# EasyEDA Pro project ProDoc_SMD test 2_2025-04-19.epro, schematic Schematic1_3
Board Name: SMD test 2; Create Date: 2025-02-23; Page Name: P1; Project Name: OASman Manifold Board v3.1.1; Schematic Name: Schematic1_3; Update Date: 2025-03-29; Company: EasyEDA.com; Page Size: A4; Version: V1.0
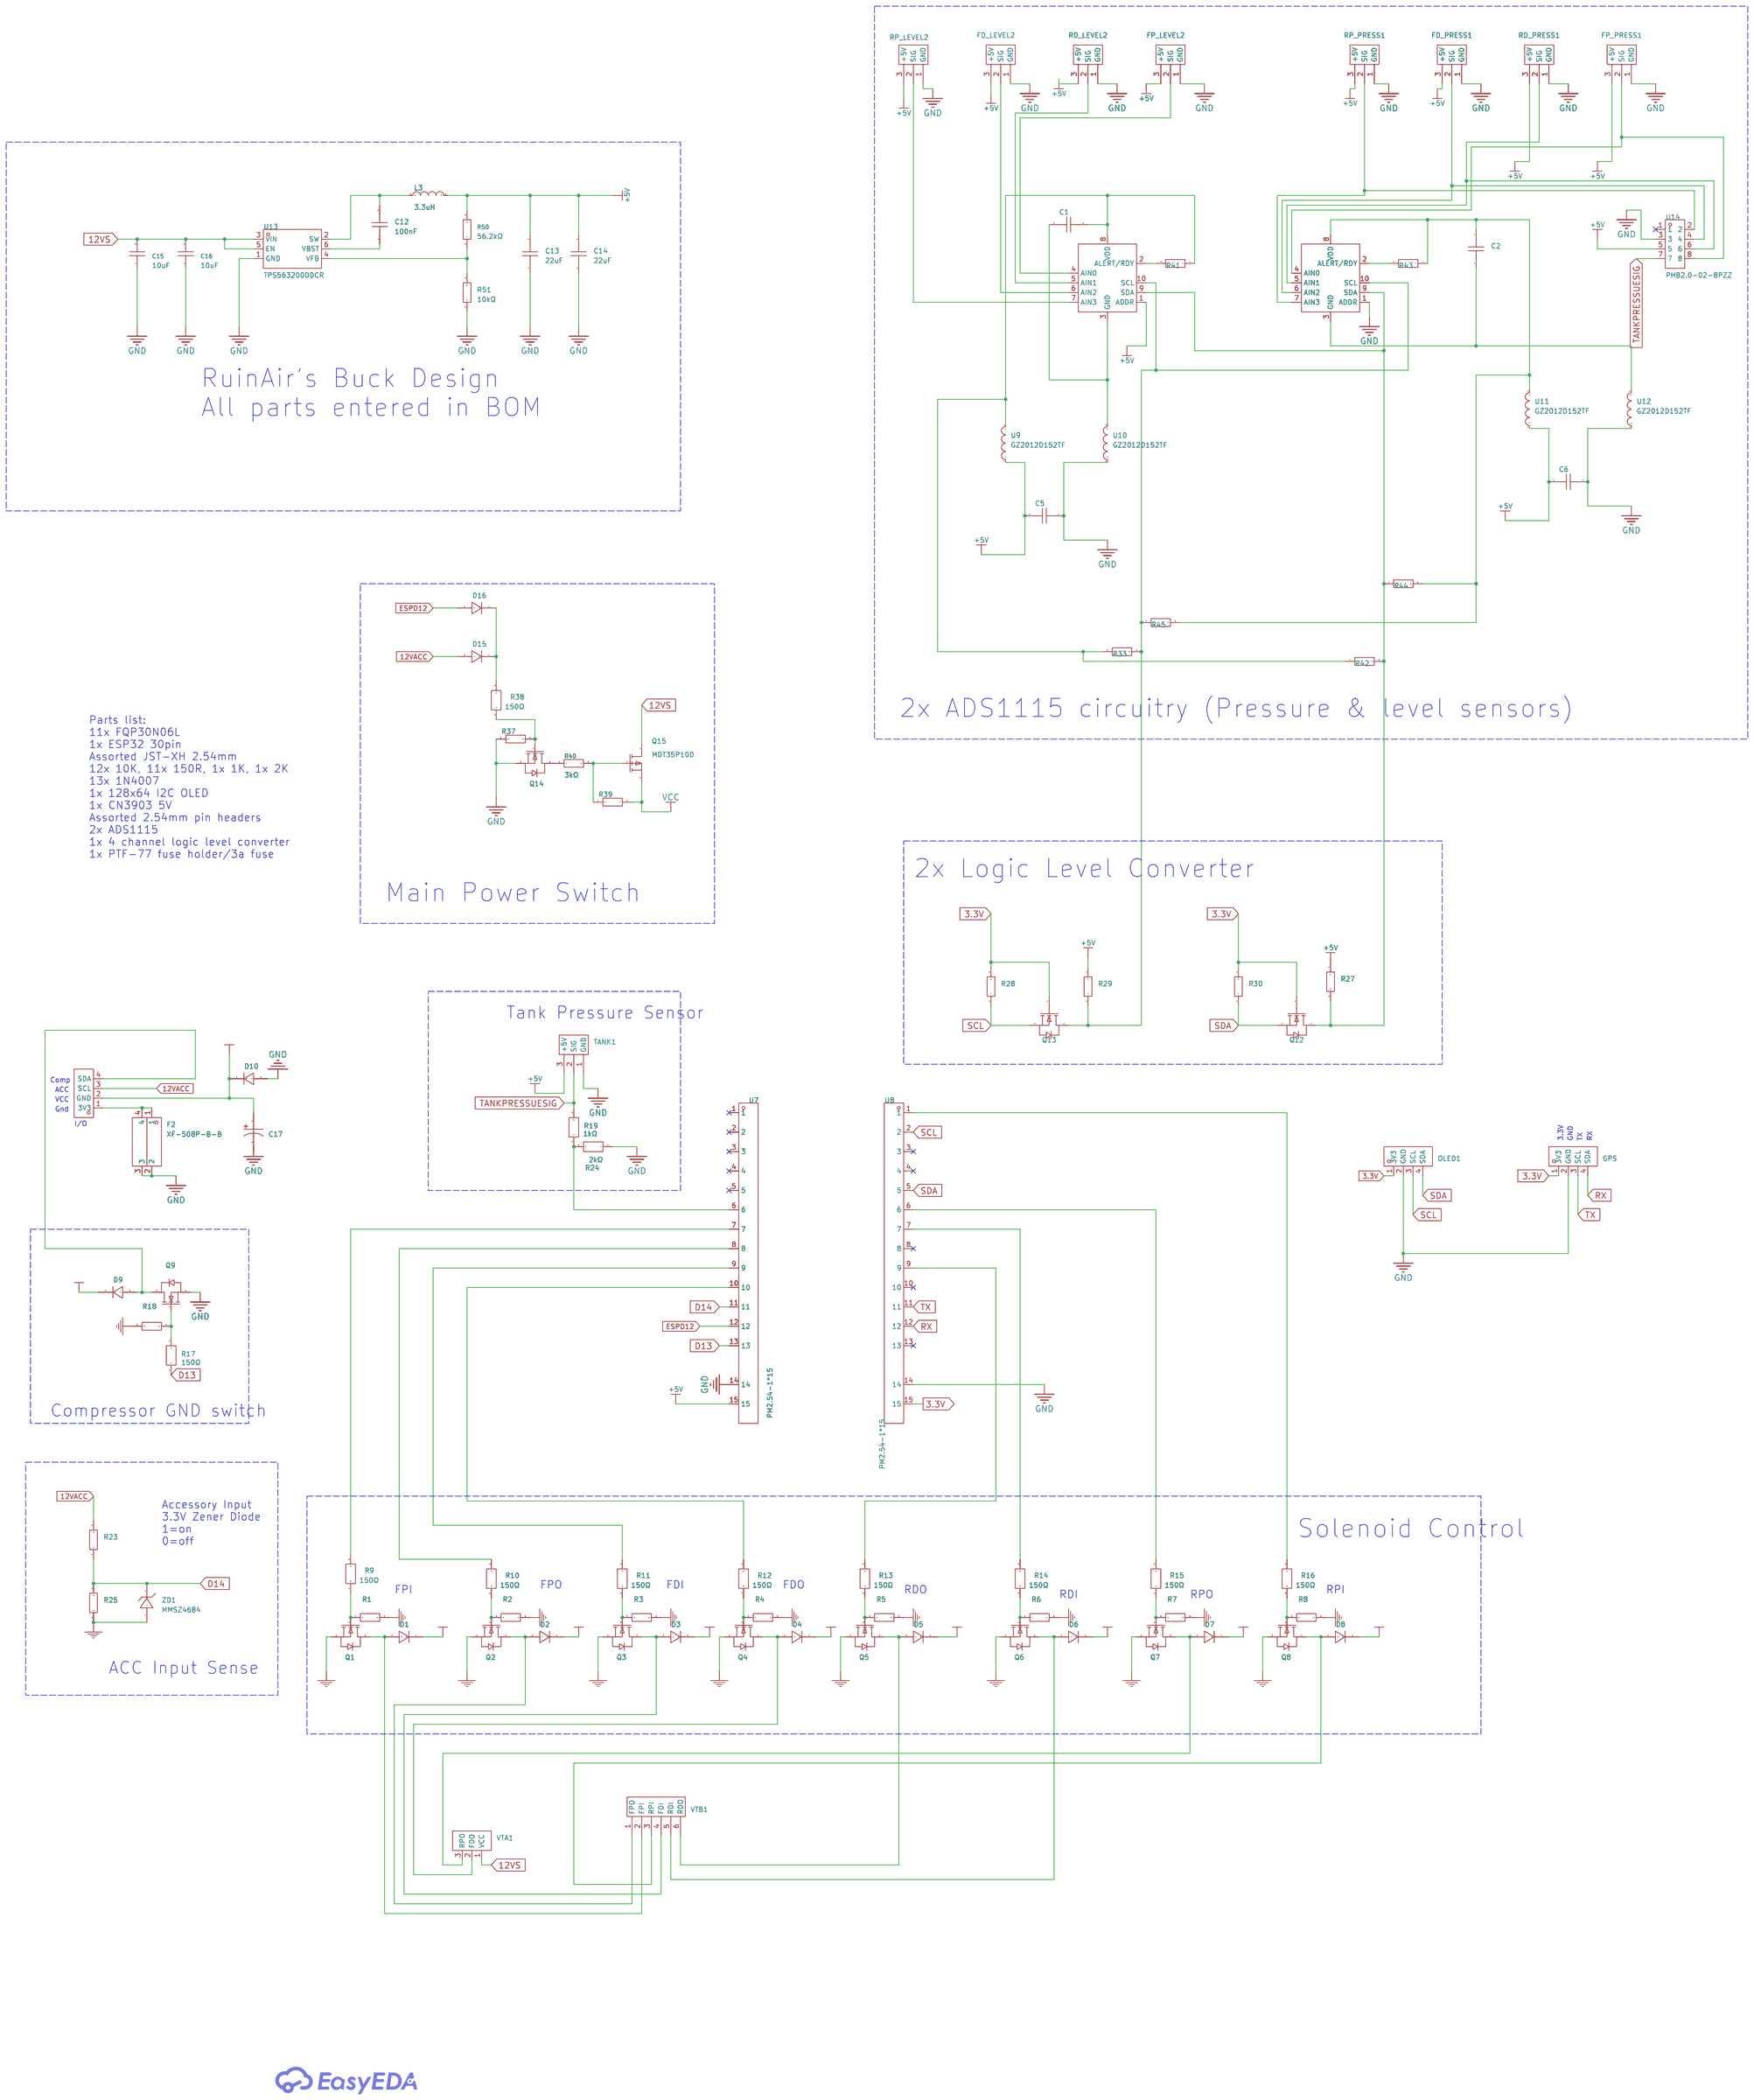
[diagram p0: schematic sheet]

## Parts
C1  1uF  [C0603]
C2  1uF  [C0603]
C5  1uF  [C0603]
C6  1uF  [C0603]
C12  100nF  [C0402]
C13  22uF  [C0805]
C14  22uF  [C0805]
C15  10uF  [C1206]
C16  10uF  [C1206]
C17  1000uF  [CAP-SMD_BD10.0-L10.3-W10.3-FD]
CN1  XH-4A绿色  [CONN-TH_XH-4A-1]
D1  SM4007PL  [SOD-123F_L2.8-W1.8-LS3.7-RD]
D2  SM4007PL  [SOD-123F_L2.8-W1.8-LS3.7-RD]
D3  SM4007PL  [SOD-123F_L2.8-W1.8-LS3.7-RD]
D4  SM4007PL  [SOD-123F_L2.8-W1.8-LS3.7-RD]
D5  SM4007PL  [SOD-123F_L2.8-W1.8-LS3.7-RD]
D6  SM4007PL  [SOD-123F_L2.8-W1.8-LS3.7-RD]
D7  SM4007PL  [SOD-123F_L2.8-W1.8-LS3.7-RD]
D8  SM4007PL  [SOD-123F_L2.8-W1.8-LS3.7-RD]
D9  SM4007PL  [SOD-123F_L2.8-W1.8-LS3.7-RD]
D10  SM4007PL  [SOD-123F_L2.8-W1.8-LS3.7-RD]
D15  SM4007PL  [SOD-123F_L2.8-W1.8-LS3.7-RD]
D16  SM4007PL  [SOD-123F_L2.8-W1.8-LS3.7-RD]
F2  XF-508P-B-B  [FUSE-TH_4P-L16.0-W6.7]
FD_LEVEL2  XH-3A  [CONN-TH_XH-3A]
FD_PRESS1  XH-3A  [CONN-TH_XH-3A]
FP_LEVEL2  XH-3A  [CONN-TH_XH-3A]
FP_PRESS1  XH-3A  [CONN-TH_XH-3A]
GPS  XH-4A绿色  [CONN-TH_XH-4A-1]
L3  3.3uH  [IND-SMD_L4.5-W4.1_SL0420]
OLED1  XH-4A绿色  [CONN-TH_XH-4A-1]
Q1  MDT30N06L  [TO-252-2_L6.6-W5.6-P4.60-LS9.7-BR]
Q2  MDT30N06L  [TO-252-2_L6.6-W5.6-P4.60-LS9.7-BR]
Q3  MDT30N06L  [TO-252-2_L6.6-W5.6-P4.60-LS9.7-BR]
Q4  MDT30N06L  [TO-252-2_L6.6-W5.6-P4.60-LS9.7-BR]
Q5  MDT30N06L  [TO-252-2_L6.6-W5.6-P4.60-LS9.7-BR]
Q6  MDT30N06L  [TO-252-2_L6.6-W5.6-P4.60-LS9.7-BR]
Q7  MDT30N06L  [TO-252-2_L6.6-W5.6-P4.60-LS9.7-BR]
Q8  MDT30N06L  [TO-252-2_L6.6-W5.6-P4.60-LS9.7-BR]
Q9  MDT30N06L  [TO-252-2_L6.6-W5.6-P4.60-LS9.7-BR]
Q12  BSS138  [SOT-23-3_L2.9-W1.6-P1.90-LS2.8-BR]
Q13  BSS138  [SOT-23-3_L2.9-W1.6-P1.90-LS2.8-BR]
Q14  MDT30N06L  [TO-252-2_L6.6-W5.6-P4.60-LS9.7-BR]
Q15  MDT35P10D  [TO-252-2_L6.6-W6.1-P4.57-LS9.9-BR-CW]
R1  10kΩ  [R1206]
R2  10kΩ  [R1206]
R3  10kΩ  [R1206]
R4  10kΩ  [R1206]
R5  10kΩ  [R1206]
R6  10kΩ  [R1206]
R7  10kΩ  [R1206]
R8  10kΩ  [R1206]
R9  150Ω  [R1206]
R10  150Ω  [R1206]
R11  150Ω  [R1206]
R12  150Ω  [R1206]
R13  150Ω  [R1206]
R14  150Ω  [R1206]
R15  150Ω  [R1206]
R16  150Ω  [R1206]
R17  150Ω  [R1206]
R18  10kΩ  [R1206]
R19  1kΩ  [R1206]
R23  10kΩ  [R1206]
R24  2kΩ  [R1206]
R25  10kΩ  [R1206]
R27  10kΩ  [R1206]
R28  10kΩ  [R1206]
R29  10kΩ  [R1206]
R30  10kΩ  [R1206]
R33  1MΩ  [R1206]
R37  10kΩ  [R1206]
R38  150Ω  [R1206]
R39  10kΩ  [R1206]
R40  3kΩ  [R1206]
R41  1MΩ  [R1206]
R42  1MΩ  [R1206]
R43  1MΩ  [R1206]
R44  1MΩ  [R1206]
R45  1MΩ  [R1206]
R50  56.2kΩ  [R0402]
R51  10kΩ  [R0402]
RD_LEVEL2  XH-3A  [CONN-TH_XH-3A]
RD_PRESS1  XH-3A  [CONN-TH_XH-3A]
RP_LEVEL2  XH-3A  [CONN-TH_XH-3A]
RP_PRESS1  XH-3A  [CONN-TH_XH-3A]
TANK1  XH-3A  [CONN-TH_XH-3A]
U4  ADS1115IDGSR  [MSOP-10_L3.0-W3.0-P0.50-LS5.0-BL]
U5  ADS1115IDGSR  [MSOP-10_L3.0-W3.0-P0.50-LS5.0-BL]
U7  PM2.54-1*15  [HDR-TH_15P-P2.54-V-F]
U8  PM2.54-1*15  [HDR-TH_15P-P2.54-V-F]
U9  GZ2012D152TF  [L0805]
U10  GZ2012D152TF  [L0805]
U11  GZ2012D152TF  [L0805]
U12  GZ2012D152TF  [L0805]
U13  TPS563200DDCR  [SOT-23-6_L2.9-W1.6-P0.95-LS2.8-BR]
U14  PHB2.0-02-8PZZ  [CONN-TH_8P-P2.00_XUNPU_PHB2.0-02-8PZZ]
VTA1  XH-3A  [CONN-TH_XH-3A]
VTB1  XH-6A  [CONN-TH_6P-P2.50_XH-6A]
ZD1  MMSZ4684  [SOD-123_L2.8-W1.8-LS3.7-RD]

## Library data of the parts
C1 C2 C5 C6 = GRM188R61H105KAALD: Capacitance: Tolerance:±10% Tolerance:±10% Voltage Rated: Temperature Coefficient:; LCSC Part Name: 1uF ±10% 50V; Supplier Part: C77386; Manufacturer: muRata(村田); Supplier Footprint: 0603; JLCPCB Part Class: Extended Part; Datasheet: https://atta.szlcsc.com/upload/public/pdf/source/20170116/1484561238855.pdf; Supplier: LCSC; Tolerance: ±10%
C12 = CL05B104KB54PNC: Capacitance: Tolerance:±10% Tolerance:±10% Voltage Rated: Temperature Coefficient:; LCSC Part Name: 100nF ±10% 50V; Supplier Part: C307331; Manufacturer: SAMSUNG(三星); Supplier Footprint: 0402; JLCPCB Part Class: Basic Part; Datasheet: https://atta.szlcsc.com/upload/public/pdf/source/20160218/1457707763339.pdf; Supplier: LCSC; Tolerance: ±10%
C13 C14 = CL21A226MAQNNNE: Capacitance: Tolerance:±20% Tolerance:±20% Voltage Rated: Temperature Coefficient:; LCSC Part Name: 22uF ±20% 25V; Supplier Part: C45783; Manufacturer: SAMSUNG(三星); Supplier Footprint: 0805; JLCPCB Part Class: Basic Part; Datasheet: https://atta.szlcsc.com/upload/public/pdf/source/20160218/1457707763339.pdf; Supplier: LCSC; Tolerance: ±20%
C15 C16 = CL31A106KBHNNNE: Capacitance: Tolerance:±10% Tolerance:±10% Voltage Rated: Temperature Coefficient:; LCSC Part Name: 10uF ±10% 50V; Supplier Part: C13585; Manufacturer: SAMSUNG(三星); Supplier Footprint: 1206; JLCPCB Part Class: Basic Part; Datasheet: https://atta.szlcsc.com/upload/public/pdf/source/20160218/1457707763339.pdf; Supplier: LCSC; Tolerance: ±10%
C17 = EEEFT1E102UP: Capacitance: Tolerance:±20% Tolerance:±20% Rated Voltage: Ripple Current:1.19A@100kHz Equivalent Series Resistance(ESR): φD: L: Lifetime @ Temp:2000hrs@105℃ Operating Temperature:-55℃~+105℃ Operating Temperature:-55℃~+105℃; LCSC Part Name: 1000uF ±20% 25V; Supplier Part: C401766; Manufacturer: PANASONIC(松下); Supplier Footprint: SMD,D10xL10.2mm; JLCPCB Part Class: Extended Part; Datasheet: https://atta.szlcsc.com/upload/public/pdf/source/20190702/C401766_FFAE6A2740111919C359AC69212D5236.pdf; Supplier: LCSC; Tolerance: ±20%; Ripple Current: 1.19A@100kHz; Lifetime @ Temp: 2000hrs@105℃; Operating Temperature: -55℃~+105℃
CN1 GPS OLED1 = XH-4A绿色: Pins Structure:1x4P Pitch:- Mounting Style:- Reference Series:XH Number of Pins:4P Number of Rows:1 Number of PINs Per Row:4 Row Spacing:- Contact Material:-; LCSC Part Name: 1x4P 系列:XH; Supplier Part: C192885; Manufacturer: BOOMELE(博穆精密); Supplier Footprint: 插件,P=2.5mm; JLCPCB Part Class: Extended Part; Supplier: LCSC; Pins Structure: 1x4P; Reference Series: XH; Number of Pins: 4P; Number of Rows: 1; Number of PINs Per Row: 4
D1-D10 D15 D16 = SM4007PL_C64898: Diode Configuration: Forward Voltage (Vf@If):1.1V@1A Reverse Voltage (Vr): Rectified Current: Reverse Leakage Current:10uA@1kV; LCSC Part Name: 电压:1kV 电流:1A; Supplier Part: C64898; Manufacturer: MDD(辰达半导体); Supplier Footprint: SOD-123FL; JLCPCB Part Class: Basic Part; Datasheet: https://atta.szlcsc.com/upload/public/pdf/source/20230823/16A8FDE162764C9B685A3717F2DA3690.pdf; Supplier: LCSC; Forward Voltage (Vf@If): 1.1V@1A; Reverse Leakage Current: 10uA@1kV
F2 = XF-508P-B-B: LCSC Part Name: 汽车保险丝座 小号; Supplier Part: C19727305; Manufacturer: XFCN(兴飞); Supplier Footprint: DIP-4; JLCPCB Part Class: Extended Part; Datasheet: https://atta.szlcsc.com/upload/public/pdf/source/20231225/025E8639FF4071685633BBEE755D2F9E.pdf; Supplier: LCSC
FD_LEVEL2 FD_PRESS1 FP_LEVEL2 FP_PRESS1 RD_LEVEL2 RD_PRESS1 RP_LEVEL2 RP_PRESS1 TANK1 VTA1 = XH-3A_C2316: Pins Structure:1x3P Pitch:2.5mm Mounting Style:- Reference Series:XH Number of Pins:3P Number of Rows:1 Number of PINs Per Row:3 Row Spacing:- Contact Material:-; LCSC Part Name: 1x3P 间距:2.5mm 系列:XH; Supplier Part: C2316; Manufacturer: BOOMELE(博穆精密); Supplier Footprint: 插件,P=2.5mm; JLCPCB Part Class: Extended Part; Datasheet: https://atta.szlcsc.com/upload/public/pdf/source/20151222/1457707654251.pdf; Supplier: LCSC; Pins Structure: 1x3P; Pitch: 2.5mm; Reference Series: XH; Number of Pins: 3P; Number of Rows: 1; Number of PINs Per Row: 3
L3 = SL0420-3R3M: Inductance: Tolerance:±20% Tolerance:±20% Rated Current: Saturation Current (Isat):4A; LCSC Part Name: 3.3uH ±20% 4A; Supplier Part: C22463807; Manufacturer: 台湾陆海; Supplier Footprint: SMD,4.5x4.1mm; JLCPCB Part Class: Extended Part; Datasheet: https://atta.szlcsc.com/upload/public/pdf/source/20240611/8DE7D6BE1273F2E871C82A6D5C20B08D.pdf; Supplier: LCSC; Tolerance: ±20%; Saturation Current (Isat): 4A
Q1-Q9 Q14 = MDT30N06L: Type:1 N-channel Drain Source Voltage (Vdss):60V Continuous Drain Current (Id): Drain Source On Resistance (RDS(on)@Vgs,Id):40mΩ@4.5V Power Dissipation (Pd): Gate Threshold Voltage (Vgs(th)@Id):1.8V@250uA Total Gate Charge (Qg@Vgs):21nC@10V Input Capacita; LCSC Part Name: 1个N沟道 耐压:60V 电流:30A; Supplier Part: C5240683; Manufacturer: minos(迈诺斯); Supplier Footprint: TO-252-2L; JLCPCB Part Class: Extended Part; Datasheet: https://atta.szlcsc.com/upload/public/pdf/source/20240829/EA64E09E95BF58FCAC7BF20D9AEBC519.pdf; Supplier: LCSC; Type: 1 N-channel; Drain Source Voltage (Vdss): 60V; Drain Source On Resistance (RDS(on)@Vgs,Id): 40mΩ@4.5V; Gate Threshold Voltage (Vgs(th)@Id): 1.8V@250uA; Total Gate Charge (Qg@Vgs): 21nC@10V; Input Capacitance (Ciss@Vds): 670pF; Reverse Transfer Capacitance (Crss@Vds): 66pF; Operating Temperature: -55℃~+175℃
Q12 Q13 = BSS138_C112239: Type:1 N-Channel Drain Source Voltage (Vdss): Continuous Drain Current (Id): Power Dissipation (Pd): Drain Source On Resistance (RDS(on)@Vgs,Id):3.5Ω@10V,220mA Gate Threshold Voltage (Vgs(th)@Id):1.5V@1mA; LCSC Part Name: 1个N沟道 耐压:50V 电流:220mA; Supplier Part: C112239; Manufacturer: SHIKUES(时科); Supplier Footprint: SOT-23; JLCPCB Part Class: Extended Part; Datasheet: https://atta.szlcsc.com/upload/public/pdf/source/20170720/1500524147280.pdf; Supplier: LCSC; Type: 1 N-Channel; Drain Source On Resistance (RDS(on)@Vgs,Id): 3.5Ω@10V,220mA; Gate Threshold Voltage (Vgs(th)@Id): 1.5V@1mA
Q15 = MDT35P10D: Type:1 Piece P-Channel Drain Source Voltage (Vdss): Continuous Drain Current (Id): Drain Source On Resistance (RDS(on)@Vgs,Id):26mΩ@10V,15A Power Dissipation (Pd): Gate Threshold Voltage (Vgs(th)@Id):2V@250uA Total Gate Charge (Qg@Vgs):40nC@10V Input Capa; LCSC Part Name: 1个P沟道 耐压:100V 电流:35A; Supplier Part: C5890267; Manufacturer: minos(迈诺斯); Supplier Footprint: TO252; JLCPCB Part Class: Extended Part; Datasheet: https://atta.szlcsc.com/upload/public/pdf/source/20230704/A90682651C9529CA52851179CB8911E0.pdf; Supplier: LCSC; Type: 1 Piece P-Channel; Drain Source On Resistance (RDS(on)@Vgs,Id): 26mΩ@10V,15A; Gate Threshold Voltage (Vgs(th)@Id): 2V@250uA; Total Gate Charge (Qg@Vgs): 40nC@10V; Input Capacitance (Ciss@Vds): 2.315nF@25V; Reverse Transfer Capacitance (Crss@Vds): 11pF@25V
R1-R8 R18 R23 R25 R27-R30 R37 R39 = 1206W4F1002T5E: Type:Thick Film Resistors Resistance:10kΩ Tolerance:±1% Tolerance:±1% Power(Watts): Overload Voltage (Max): Temperature Coefficient:±100ppm/℃ Temperature Coefficient:±100ppm/℃ Operating Temperature Range:-55℃~+155℃ Operating Temperature Range:-55℃~+155℃; LCSC Part Name: 10kΩ ±1% 250mW 厚膜电阻; Supplier Part: C17902; Manufacturer: UNI-ROYAL(厚声); Supplier Footprint: 1206; JLCPCB Part Class: Basic Part; Datasheet: https://atta.szlcsc.com/upload/public/pdf/source/20200306/C422600_1E6D84923E4A46A82E41ADD87F860B5C.pdf; Supplier: LCSC; Type: Thick Film Resistors; Tolerance: ±1%; Temperature Coefficient: ±100ppm/℃; Operating Temperature Range: -55℃~+155℃
R9-R17 R38 = FRC1206J151 TS: Type:Thick Film Resistors Resistance: Tolerance:±5% Tolerance:±5% Power(Watts): Overload Voltage (Max): Temperature Coefficient:±100ppm/℃ Temperature Coefficient:±100ppm/℃ Operating Temperature Range:-55℃~+155℃ Operating Temperature Range:-55℃~+155℃; LCSC Part Name: 150Ω ±5% 250mW 厚膜电阻; Supplier Part: C2907432; Manufacturer: FOJAN(富捷); Supplier Footprint: 1206; JLCPCB Part Class: Extended Part; Datasheet: https://atta.szlcsc.com/upload/public/pdf/source/20211221/925EC7D7225764EE0046F22065062C87.pdf; Supplier: LCSC; Type: Thick Film Resistors; Tolerance: ±5%; Temperature Coefficient: ±100ppm/℃; Operating Temperature Range: -55℃~+155℃
R19 = FRC1206J102 TS: Type:Thick Film Resistors Resistance:1kΩ Tolerance:±5% Tolerance:±5% Power(Watts): Overload Voltage (Max): Temperature Coefficient:±100ppm/℃ Temperature Coefficient:±100ppm/℃ Operating Temperature Range:-55℃~+155℃ Operating Temperature Range:-55℃~+155℃; LCSC Part Name: 1kΩ ±5% 250mW 厚膜电阻; Supplier Part: C2907440; Manufacturer: FOJAN(富捷); Supplier Footprint: 1206; JLCPCB Part Class: Extended Part; Datasheet: https://atta.szlcsc.com/upload/public/pdf/source/20211221/925EC7D7225764EE0046F22065062C87.pdf; Supplier: LCSC; Type: Thick Film Resistors; Tolerance: ±5%; Temperature Coefficient: ±100ppm/℃; Operating Temperature Range: -55℃~+155℃
R24 = FRC1206J202 TS: Type:Thick Film Resistors Resistance:2kΩ Tolerance:±5% Tolerance:±5% Power(Watts): Overload Voltage (Max): Temperature Coefficient:±100ppm/℃ Temperature Coefficient:±100ppm/℃ Operating Temperature Range:-55℃~+155℃ Operating Temperature Range:-55℃~+155℃; LCSC Part Name: 2kΩ ±5% 250mW 厚膜电阻; Supplier Part: C2907466; Manufacturer: FOJAN(富捷); Supplier Footprint: 1206; JLCPCB Part Class: Extended Part; Datasheet: https://atta.szlcsc.com/upload/public/pdf/source/20211221/925EC7D7225764EE0046F22065062C87.pdf; Supplier: LCSC; Type: Thick Film Resistors; Tolerance: ±5%; Temperature Coefficient: ±100ppm/℃; Operating Temperature Range: -55℃~+155℃
R33 R41-R45 = 1206W4F1004T5E: Type:Thick Film Resistors Resistance:1MΩ Tolerance:±1% Tolerance:±1% Power(Watts): Overload Voltage (Max): Temperature Coefficient:±100ppm/℃ Temperature Coefficient:±100ppm/℃ Operating Temperature Range:-55℃~+155℃ Operating Temperature Range:-55℃~+155℃; LCSC Part Name: 1MΩ ±1% 250mW 厚膜电阻; Supplier Part: C17927; Manufacturer: UNI-ROYAL(厚声); Supplier Footprint: 1206; JLCPCB Part Class: Basic Part; Datasheet: https://atta.szlcsc.com/upload/public/pdf/source/20200306/C422600_1E6D84923E4A46A82E41ADD87F860B5C.pdf; Supplier: LCSC; Type: Thick Film Resistors; Tolerance: ±1%; Temperature Coefficient: ±100ppm/℃; Operating Temperature Range: -55℃~+155℃
R40 = 1206W4F3001T5E: Type:Thick Film Resistors Resistance:3kΩ Tolerance:±1% Tolerance:±1% Power(Watts): Overload Voltage (Max): Temperature Coefficient:±100ppm/℃ Temperature Coefficient:±100ppm/℃ Operating Temperature Range:-55℃~+155℃ Operating Temperature Range:-55℃~+155℃; LCSC Part Name: 3kΩ ±1% 250mW 厚膜电阻; Supplier Part: C18012; Manufacturer: UNI-ROYAL(厚声); Supplier Footprint: 1206; JLCPCB Part Class: Extended Part; Datasheet: https://atta.szlcsc.com/upload/public/pdf/source/20200306/C422600_1E6D84923E4A46A82E41ADD87F860B5C.pdf; Supplier: LCSC; Type: Thick Film Resistors; Tolerance: ±1%; Temperature Coefficient: ±100ppm/℃; Operating Temperature Range: -55℃~+155℃
R50 = 0402WGF5622TCE: Type:Thick Film Resistors Resistance:56.2kΩ Tolerance:±1% Tolerance:±1% Power(Watts): Overload Voltage (Max): Temperature Coefficient:±100ppm/℃ Temperature Coefficient:±100ppm/℃ Operating Temperature Range:-55℃~+155℃ Operating Temperature Range:-55℃~+155℃; LCSC Part Name: 56.2kΩ ±1% 62.5mW 厚膜电阻; Supplier Part: C54968; Manufacturer: UNI-ROYAL(厚声); Supplier Footprint: 0402; JLCPCB Part Class: Extended Part; Datasheet: https://atta.szlcsc.com/upload/public/pdf/source/20200306/C422600_1E6D84923E4A46A82E41ADD87F860B5C.pdf; Supplier: LCSC; Type: Thick Film Resistors; Tolerance: ±1%; Temperature Coefficient: ±100ppm/℃; Operating Temperature Range: -55℃~+155℃
R51 = 0402WGF1002TCE: Type:Thick Film Resistors Resistance:10kΩ Tolerance:±1% Tolerance:±1% Power(Watts): Overload Voltage (Max): Temperature Coefficient:±100ppm/℃ Temperature Coefficient:±100ppm/℃ Operating Temperature Range:-55℃~+155℃ Operating Temperature Range:-55℃~+155℃; LCSC Part Name: 10kΩ ±1% 62.5mW 厚膜电阻; Supplier Part: C25744; Manufacturer: UNI-ROYAL(厚声); Supplier Footprint: 0402; JLCPCB Part Class: Basic Part; Datasheet: https://atta.szlcsc.com/upload/public/pdf/source/20200306/C422600_1E6D84923E4A46A82E41ADD87F860B5C.pdf; Supplier: LCSC; Type: Thick Film Resistors; Tolerance: ±1%; Temperature Coefficient: ±100ppm/℃; Operating Temperature Range: -55℃~+155℃
U4 U5 = ADS1115IDGSR: Interface:I2C differential input:Yes number of channels:2 Supply Voltage:2V~5.5V Supply Voltage:2V~5.5V sampling frequency:860Hz resolution:16Bit Operating Temperature:-40℃~+125℃ Operating Temperature:-40℃~+125℃; LCSC Part Name: 具有内部基准、振荡器和可编程比较器且兼容 I2C 的ADS111x、超小型、低功耗 860SPS、16位ADC; Supplier Part: C37593; Manufacturer: TI(德州仪器); Supplier Footprint: VSSOP-10; JLCPCB Part Class: Extended Part; Datasheet: https://www.ti.com/cn/lit/gpn/ads1115; Supplier: LCSC; Interface: I2C; differential input: Yes; number of channels: 2; Supply Voltage: 2V~5.5V; sampling frequency: 860Hz; resolution: 16Bit; Operating Temperature: -40℃~+125℃
U7 U8 = PM2.54-1*15: Holes Structure:1x15P Pitch:2.54mm Number of Rows:Plugin Contact Plating:Gold; LCSC Part Name: 1x15P 间距:2.54mm; Supplier Part: C5371989; Manufacturer: ZHOURI(洲日); Supplier Footprint: 插件,P=2.54mm; JLCPCB Part Class: Extended Part; Supplier: LCSC; Holes Structure: 1x15P; Pitch: 2.54mm; Number of Rows: Plugin; Contact Plating: Gold
U9-U12 = GZ2012D152TF: Impedance @ Frequency:1.5kΩ@100MHz Tolerance:±25% Tolerance:±25% DC Resistance:400mΩ Current Rating:500mA Circuits:1; LCSC Part Name: 单路 0805磁珠 阻抗1.5kΩ@100MHz; Supplier Part: C96710; Manufacturer: Sunlord(顺络); Supplier Footprint: 0805; JLCPCB Part Class: Extended Part; Datasheet: https://atta.szlcsc.com/upload/public/pdf/source/20231030/9B6A3E87682CEC1FF6638DFAA81D73FA.pdf; Supplier: LCSC; Impedance @ Frequency: 1.5kΩ@100MHz; Tolerance: ±25%; DC Resistance: 400mΩ; Current Rating: 500mA; Circuits: 1
U13 = TPS563200DDCR: Function:Step-down type Output Type:Adjustable Input Voltage:4.5V~17V Input Voltage:4.5V~17V Output Voltage:760mV~7V Output Voltage:760mV~7V Output Current:3A Switching Frequency:650kHz Switching Frequency:650kHz Operating Temperature:-40℃~+125℃ Operating; LCSC Part Name: 4.5V至17V输入,2A/3A同步降压稳压器; Supplier Part: C97253; Manufacturer: TI(德州仪器); Supplier Footprint: TSOT-23-6; JLCPCB Part Class: Extended Part; Datasheet: https://www.ti.com/cn/lit/gpn/tps563200; Supplier: LCSC; Function: Step-down type; Output Type: Adjustable; Input Voltage: 4.5V~17V; Output Voltage: 760mV~7V; Output Current: 3A; Switching Frequency: 650kHz; Operating Temperature: -40℃~+125℃; Synchronous Rectification: Yes; Number of Outputs: 1; Topology: Step-down; Quiescent Current (Iq): 290uA; Switch tube (built-in/external): Built-in
U14 = PHB2.0-02-8PZZ: Pins Structure:2x4P Pitch:2mm Mounting Type:Direct Insert Reference Series:PHB Number of Pins:8P Number of Rows:2 Number of PINs Per Row:4 Row Spacing:2mm Current Rating:3A Contact Material:- Contact Plating:- Operating Temperature:-25℃~+85℃ Operating Tem; LCSC Part Name: 2x4P 间距:2mm 直插 系列:PHB; Supplier Part: C19089136; Manufacturer: XUNPU(讯普); Supplier Footprint: 直插,P=2mm; JLCPCB Part Class: Extended Part; Datasheet: https://atta.szlcsc.com/upload/public/pdf/source/20231025/E6D319634D2FEC92D75A874DF46F6A7E.pdf; Supplier: LCSC; Pins Structure: 2x4P; Pitch: 2mm; Mounting Type: Direct Insert; Reference Series: PHB; Number of Pins: 8P; Number of Rows: 2; Number of PINs Per Row: 4; Row Spacing: 2mm; Current Rating: 3A; Operating Temperature: -25℃~+85℃; Voltage Rating: 250V; Color: Beige; Z-Height of the Board: 8.1mm; X-Length of Bottom Edge on Board (Spacing Line): 10mm; Y-Width of Bottom Edge on Board: 8mm
VTB1 = XH-6A_C5663: Pins Structure:1x6P Pitch:2.5mm Mounting Style:- Reference Series:XH Number of Pins:6P Number of Rows:1 Number of PINs Per Row:6 Row Spacing:- Contact Material:-; LCSC Part Name: 系列:XH 间距:2.5mm 1x6P; Supplier Part: C5663; Manufacturer: BOOMELE(博穆精密); Supplier Footprint: 插件,P=2.5mm; JLCPCB Part Class: Extended Part; Datasheet: https://atta.szlcsc.com/upload/public/pdf/source/20151222/1457707654251.pdf; Supplier: LCSC; Pins Structure: 1x6P; Pitch: 2.5mm; Reference Series: XH; Number of Pins: 6P; Number of Rows: 1; Number of PINs Per Row: 6
ZD1 = MMSZ4684: Diode Configuration:Independent Type Zener Voltage (Nom):3.3V Reverse Leakage Current (Ir):7.5uA@1.5V Zener Voltage (Range):3.13V~3.47V Zener Voltage (Range):3.13V~3.47V Power Dissipation:350mW Zener Impedance (Zzt):-; LCSC Part Name: 丝印CK; Supplier Part: C21510; Manufacturer: CJ(江苏长电/长晶); Supplier Footprint: SOD-123; JLCPCB Part Class: Extended Part; Datasheet: https://atta.szlcsc.com/upload/public/pdf/source/20140301/1457707001493.pdf; Supplier: LCSC; Diode Configuration: Independent Type; Zener Voltage (Nom): 3.3V; Reverse Leakage Current (Ir): 7.5uA@1.5V; Zener Voltage (Range): 3.13V~3.47V; Power Dissipation: 350mW

## Nets
3.3V: GPS.1(3V3) OLED1.1(3V3) Q12.1(G) Q13.1(G) R28.2 R30.2 U8.15
12VACC: CN1.3(SCL) D15.2(A) R23.2
12VS: C15.2 C16.2 Q15.2(D) U13.3(VIN) U13.5(EN) VTA1.1(VCC)
+5V: C5.2 C6.2 C13.2 C14.2 FD_LEVEL2.3(+5V) FD_PRESS1.3(+5V) FP_LEVEL2.3(+5V) FP_PRESS1.3(+5V) L3.2 R27.1 R29.2 R50.2 RD_LEVEL2.3(+5V) RD_PRESS1.3(+5V) RP_LEVEL2.3(+5V) RP_PRESS1.3(+5V) TANK1.3(+5V) U4.1(ADDR) U7.15 U9.1 U11.1 U14.5
GND: C5.1 C6.1 C13.1 C14.1 C15.1 C16.1 C17.2 D10.2(A) F2.2 F2.3 FD_LEVEL2.1(GND) FD_PRESS1.1(GND) FP_LEVEL2.1(GND) FP_PRESS1.1(GND) GPS.2(GND) OLED1.2(GND) Q1.3(S) Q2.3(S) Q3.3(S) Q4.3(S) Q5.3(S) Q6.3(S) Q7.3(S) Q8.3(S) Q9.3(S) Q14.3(S) R1.2 R2.2 R3.2 R4.2 R5.2 R6.2 R7.2 R8.2 R18.2 R24.1 R25.1 R37.2 R51.1 RD_LEVEL2.1(GND) RD_PRESS1.1(GND) RP_LEVEL2.1(GND) RP_PRESS1.1(GND) TANK1.1(GND) U5.1(ADDR) U7.14 U8.14 U10.1 U12.1 U13.1(GND) U14.3 ZD1.2(A)
VCC: C17.1 CN1.2(GND) D1.1(C) D2.1(C) D3.1(C) D4.1(C) D5.1(C) D6.1(C) D7.1(C) D8.1(C) D9.1(C) D10.1(C) Q15.3(S) R39.1
D13: R17.2 U7.13
D14: R23.1 R25.2 U7.11 ZD1.1(K)
ESPD12: D16.2(A) U7.12
RX: GPS.4(SDA) U8.12
SCL: OLED1.3(SCL) Q13.2(S) R28.1 U8.2
SDA: OLED1.4(SDA) Q12.2(S) R30.1 U8.5
TANKPRESSUESIG: R19.2 TANK1.2(SIG) U14.7
TX: GPS.3(SCL) U8.11
$1N4350: Q8.1(G) R8.1 R16.1
$1N4351: Q7.1(G) R7.1 R15.1
$1N4352: Q6.1(G) R6.1 R14.1
$1N4353: Q5.1(G) R5.1 R13.1
$1N4354: Q4.1(G) R4.1 R12.1
$1N4355: Q3.1(G) R3.1 R11.1
$1N4356: Q2.1(G) R2.1 R10.1
$1N4357: Q1.1(G) R1.1 R9.1
$1N4371: D4.2(A) Q4.2(D) VTA1.2(FDO)
$1N4376: Q9.1(G) R17.1 R18.1
$1N4377: R10.2 U7.8
$1N4378: R11.2 U7.9
$1N4379: CN1.4(SDA) D9.2(A) Q9.2(D)
$1N4380: R13.2 U8.9
$1N4381: R14.2 U8.7
$1N4383: R19.1 R24.2 U7.6
$1N4402: C2.1 R43.1 R44.2 R45.2 U5.8(VDD) U11.2
$1N4403: FD_LEVEL2.2(SIG) U4.6(AIN2)
$1N4407: FP_LEVEL2.2(SIG) U4.4(AIN0)
$1N4413: RD_LEVEL2.2(SIG) U4.5(AIN1)
$1N4416: RD_PRESS1.2(SIG) U5.5(AIN1) U14.6
$1N4419: C1.1 R33.1 R41.1 R42.1 U4.8(VDD) U9.2
$1N4423: RP_LEVEL2.2(SIG) U4.7(AIN3)
$1N4424: FD_PRESS1.2(SIG) U5.6(AIN2) U14.4
$1N4428: RP_PRESS1.2(SIG) U5.7(AIN3) U14.2
$1N4436: R16.2 U8.1
$1N4438: R9.2 U7.7
$1N4442: R15.2 U8.6
$1N4443: FP_PRESS1.2(SIG) U5.4(AIN0) U14.8
$1N4453: Q12.3(D) R27.2 R42.2 R44.1 U4.9(SDA) U5.9(SDA)
$1N4460: R12.2 U7.10
$1N4475: Q14.2(D) R40.1
$1N4476: Q15.1(G) R39.2 R40.2
$1N4478: Q14.1(G) R37.1 R38.1
$1N4481: D7.2(A) Q7.2(D) VTA1.3(RPO)
$1N12707: C1.2 U4.3(GND) U10.2
$1N12784: R41.2 U4.2(ALERT/RDY)
$1N13030: C2.2 U5.3(GND) U12.2
$1N13089: R43.2 U5.2(ALERT/RDY)
$1N19403: Q13.3(D) R29.1 R33.2 R45.1 U4.10(SCL) U5.10(SCL)
$1N23795: D15.1(C) D16.1(C) R38.2
$1N33541: C12.1 U13.6(VBST)
$1N33542: C12.2 L3.1 U13.2(SW)
$1N33547: R50.1 R51.2 U13.4(VFB)
$1N77029: CN1.1(3V3) F2.1 F2.4
Net-(D1-2): D1.2(A) Q1.2(D) VTB1.2(FPI)
Net-(D2-2): D2.2(A) Q2.2(D) VTB1.1(FPO)
Net-(D3-2): D3.2(A) Q3.2(D) VTB1.4(FDI)
Net-(D5-2): D5.2(A) Q5.2(D) VTB1.6(RDO)
Net-(D6-2): D6.2(A) Q6.2(D) VTB1.5(RDI)
Net-(D8-2): D8.2(A) Q8.2(D) VTB1.3(RPI)

Not connected (* = marked no-connect by the designer): U7 1* 2* 3* 4* 5*; U8 3* 4* 8* 10* 13*; U14 1*

## Notes on the sheet
- RuinAir's Buck Design
  All parts entered in BOM
- Parts list:
  11x FQP30N06L
  1x ESP32 30pin
  Assorted JST-XH 2.54mm
  12x 10K, 11x 150R, 1x 1K, 1x 2K
  13x 1N4007
  1x 128x64 I2C OLED
  1x CN3903 5V
  Assorted 2.54mm pin headers
  2x ADS1115
  1x 4 channel logic level converter
  1x PTF-77 fuse holder/3a fuse
- 2x ADS1115 circuitry (Pressure & level sensors)
- 2x Logic Level Converter
- Main Power Switch
- Tank Pressure Sensor
- Comp
- ACC
- VCC
- Gnd
- I/O
- 3.3V
- GND
- TX
- RX
- Compressor GND switch
- Accessory Input
  3.3V Zener Diode
  1=on
  0=off
- Solenoid Control
- FPO
- FDI
- FDO
- FPI
- RDO
- RDI
- RPO
- RPI
- ACC Input Sense
